# Altium schematic sheet Microcontroller.SchDoc
size A3
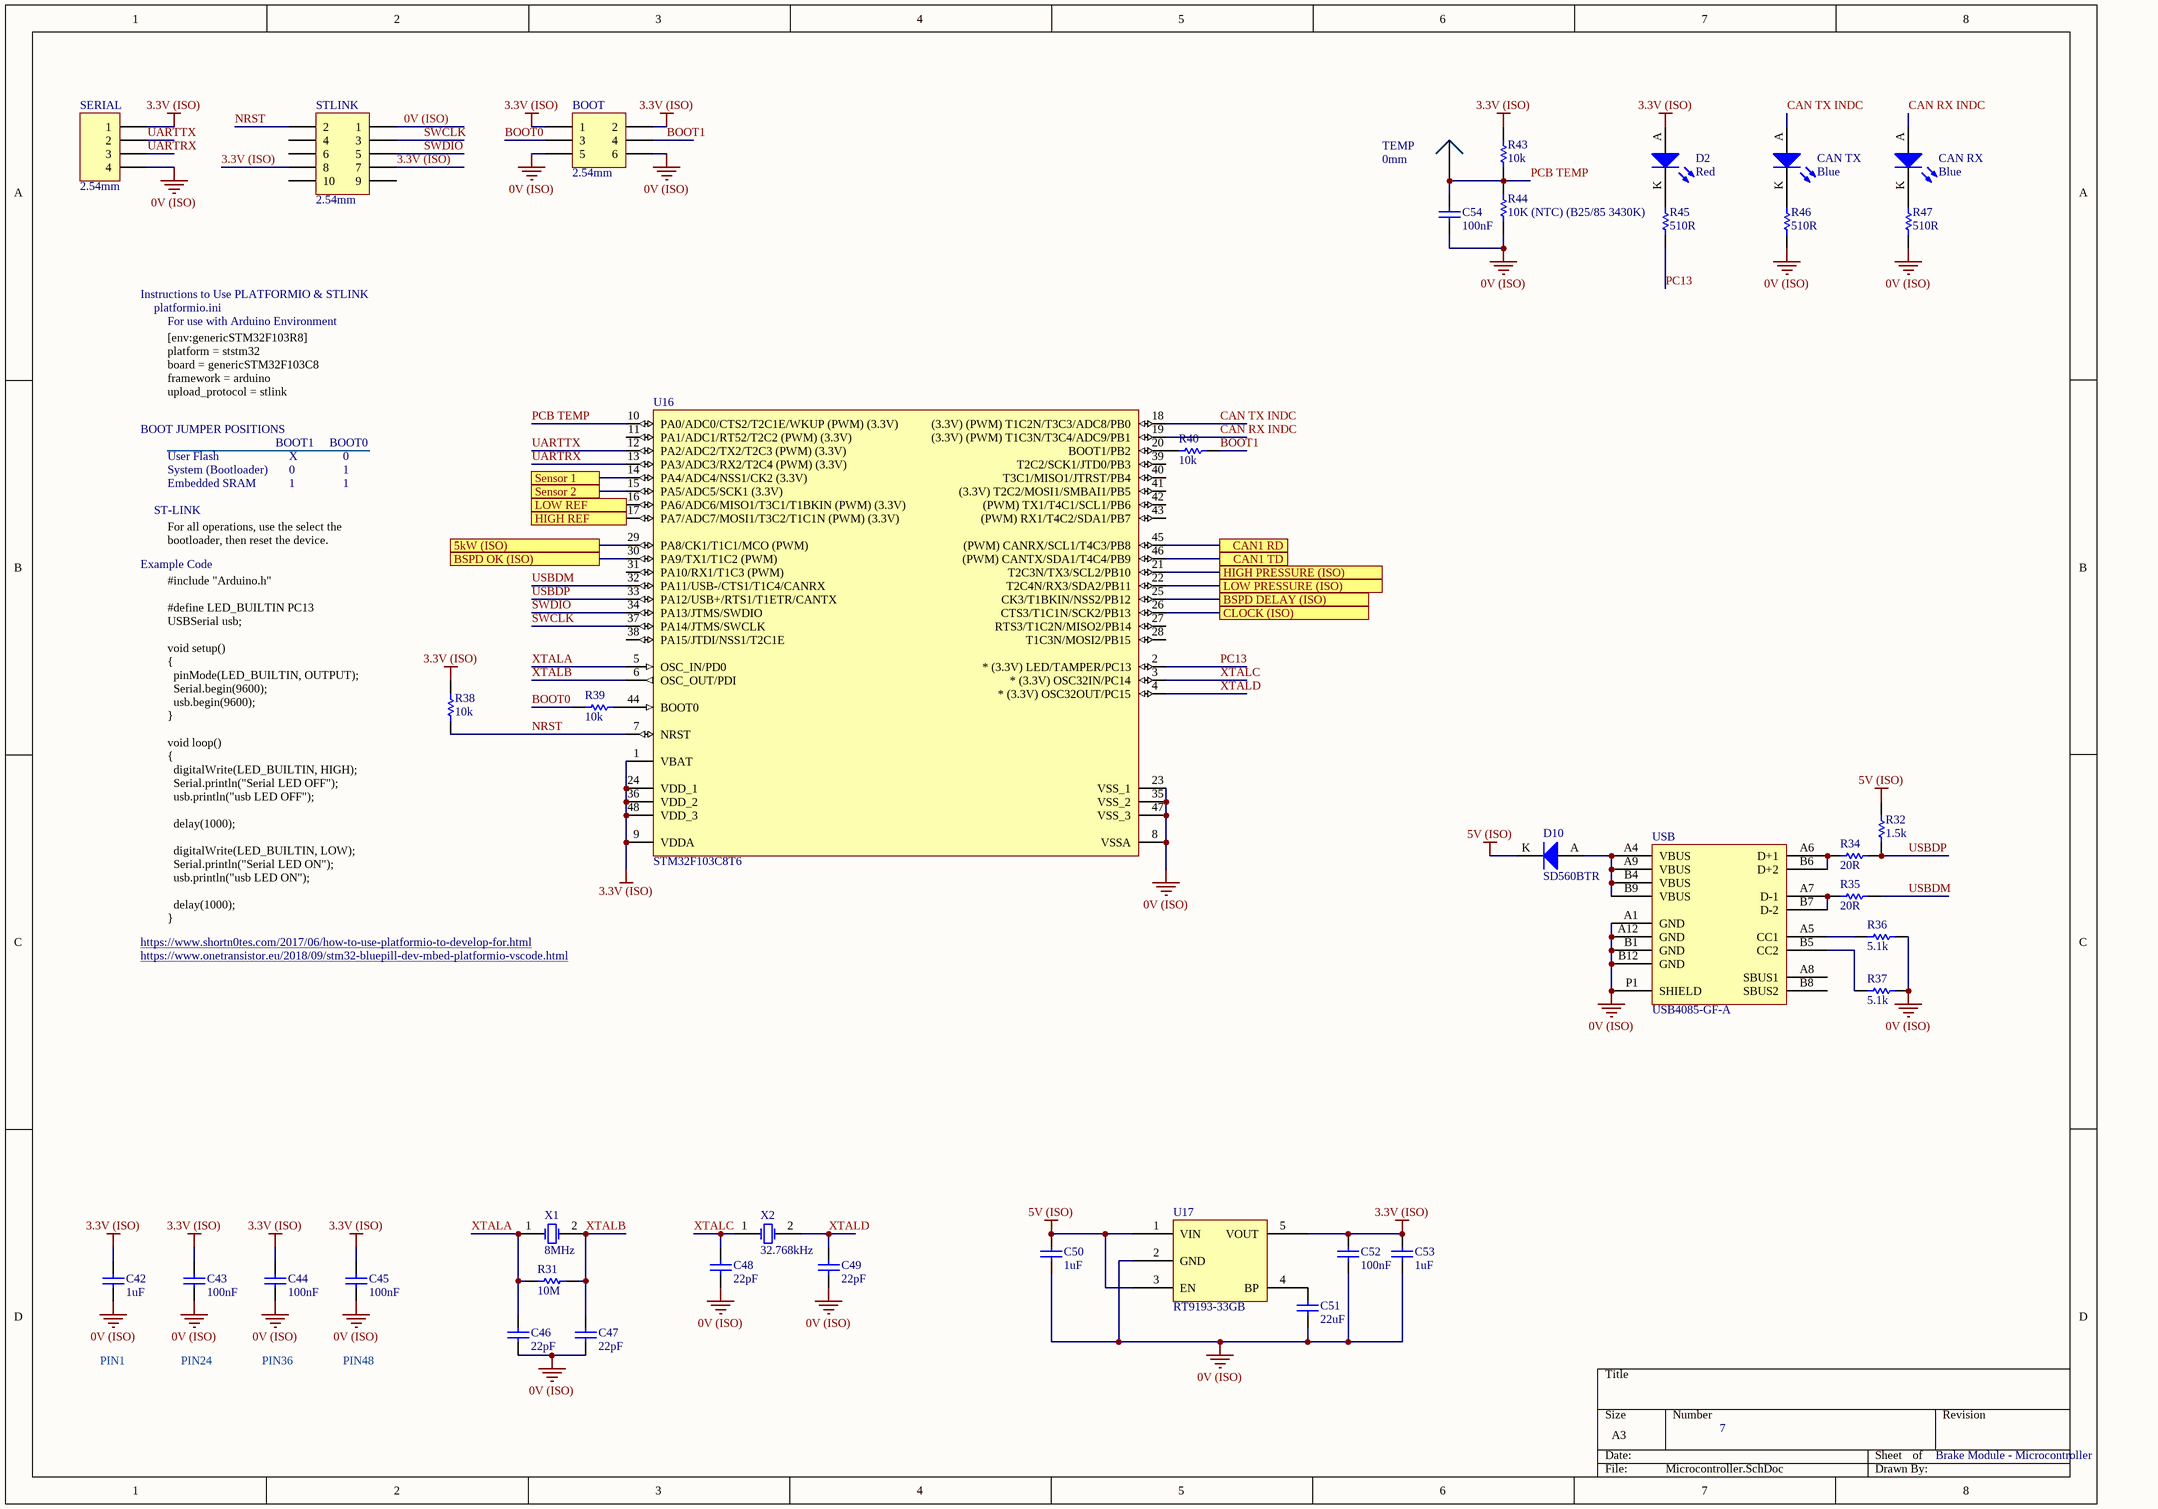
[diagram p0: Microcontroller.SchDoc]

## Parts
BOOT  2.54mm  [TH 2.54mm Header 2x3]
C42  1uF  [0805]
C43  100nF  [0805]
C44  100nF  [0805]
C45  100nF  [0805]
C46  22pF  [0805]
C47  22pF  [0805]
C48  22pF  [0805]
C49  22pF  [0805]
C50  1uF  [0805]
C51  22uF  [1206]
C52  100nF  [0805]
C53  1uF  [0805]
C54  100nF  [0805]
CAN_RX  Blue  [0805 LED]
CAN_TX  Blue  [0805 LED]
D2  Red  [0805 LED]
D10  SD560BTR  [SMB Diode]
R31  10M  [0805]
R32  1.5k  [0805]
R34  20R  [0805]
R35  20R  [0805]
R36  5.1k  [0805]
R37  5.1k  [0805]
R38  10k  [0805]
R39  10k  [0805]
R40  10k  [0805]
R43  10k  [0805]
R44  10K (NTC) (B25/85 3430K)  [0805]
R45  510R  [0805]
R46  510R  [0805]
R47  510R  [0805]
SERIAL  2.54mm  [TH 2.54mm Header 1x4]
STLINK  2.54mm  [TH 2.54mm Header 2x5]
TEMP  0mm  [SMD Test Point]
U16  STM32F103C8T6  [STM 48-LQFP]
U17  RT9193-33GB  [RICHTEK SOT-23-5]
USB  USB4085-GF-A  [USB4085-GF-A]
X1  8MHz  [Abracon HC-49/US]
X2  32.768kHz  [EPSON 2-SMD]

## Ports
5kW (ISO), BSPD DELAY (ISO), BSPD OK (ISO), CAN1 RD, CAN1 TD, CLOCK (ISO), HIGH PRESSURE (ISO), HIGH REF (in), LOW PRESSURE (ISO), LOW REF (in), Sensor 1, Sensor 2

## Nets
0V (ISO): BOOT.5 BOOT.6 C42.1 C43.1 C44.1 C45.1 C46.1 C47.1 C48.1 C49.1 C50.1 C51.1 C52.1 C53.1 C54.1 R36.2 R37.2 R44.1 R46.1 R47.1 SERIAL.4 STLINK.1 U16.8(VSSA) U16.23(VSS_1) U16.35(VSS_2) U16.47(VSS_3) U17.2(GND) USB.A1(GND) USB.A12(GND) USB.B1(GND) USB.B12(GND) USB.P1(SHIELD)
3.3V (ISO): BOOT.1 BOOT.2 C42.2 C43.2 C44.2 C45.2 C52.2 C53.2 D2.A R38.2 R43.2 SERIAL.1 STLINK.7 STLINK.8 U16.1(VBAT) U16.9(VDDA) U16.24(VDD_1) U16.36(VDD_2) U16.48(VDD_3) U17.5(VOUT)
5V (ISO): C50.2 D10.K R32.2 U17.1(VIN) U17.3(EN)
5kW (ISO): U16.29(PA8/CK1/T1C1/MCO_(PWM)) ; port 5kW (ISO)
BOOT0: BOOT.3 R39.1
BOOT1: BOOT.4 R40.2
BSPD DELAY (ISO): U16.25(CK3/T1BKIN/NSS2/PB12) ; port BSPD DELAY (ISO)
BSPD OK (ISO): U16.30(PA9/TX1/T1C2_(PWM)) ; port BSPD OK (ISO)
CAN1 RD: U16.45((PWM)_CANRX/SCL1/T4C3/PB8) ; port CAN1 RD
CAN1 TD: U16.46((PWM)_CANTX/SDA1/T4C4/PB9) ; port CAN1 TD
CAN RX INDC: CAN_RX.A U16.19((3.3V)_(PWM)_T1C3N/T3C4/ADC9/PB1)
CAN TX INDC: CAN_TX.A U16.18((3.3V)_(PWM)_T1C2N/T3C3/ADC8/PB0)
CLOCK (ISO): U16.26(CTS3/T1C1N/SCK2/PB13) ; port CLOCK (ISO)
HIGH PRESSURE (ISO): U16.21(T2C3N/TX3/SCL2/PB10) ; port HIGH PRESSURE (ISO)
HIGH REF: U16.17(PA7/ADC7/MOSI1/T3C2/T1C1N_(PWM)_(3.3V)) ; port HIGH REF
LOW PRESSURE (ISO): U16.22(T2C4N/RX3/SDA2/PB11) ; port LOW PRESSURE (ISO)
LOW REF: U16.16(PA6/ADC6/MISO1/T3C1/T1BKIN_(PWM)_(3.3V)) ; port LOW REF
NRST: R38.1 STLINK.2 U16.7(NRST)
PC13: R45.1 U16.2(*_(3.3V)_LED/TAMPER/PC13)
PCB TEMP: C54.2 R43.1 R44.2 TEMP.1 U16.10(PA0/ADC0/CTS2/T2C1E/WKUP_(PWM)_(3.3V))
Sensor 1: U16.14(PA4/ADC4/NSS1/CK2_(3.3V)) ; port Sensor 1
Sensor 2: U16.15(PA5/ADC5/SCK1_(3.3V)) ; port Sensor 2
SWCLK: STLINK.3 U16.37(PA14/JTMS/SWCLK)
SWDIO: STLINK.5 U16.34(PA13/JTMS/SWDIO)
UARTRX: SERIAL.3 U16.13(PA3/ADC3/RX2/T2C4_(PWM)_(3.3V))
UARTTX: SERIAL.2 U16.12(PA2/ADC2/TX2/T2C3_(PWM)_(3.3V))
USBDM: R35.2 U16.32(PA11/USB-/CTS1/T1C4/CANRX)
USBDP: R32.1 R34.2 U16.33(PA12/USB+/RTS1/T1ETR/CANTX)
XTALA: C46.2 R31.1 U16.5(OSC_IN/PD0) X1.1(OSC1)
XTALB: C47.2 R31.2 U16.6(OSC_OUT/PDI) X1.2(OSC2)
XTALC: C48.2 U16.3(*_(3.3V)_OSC32IN/PC14) X2.1(OSC1)
XTALD: C49.2 U16.4(*_(3.3V)_OSC32OUT/PC15) X2.2(OSC2)
NetC51_2: C51.2 U17.4(BP)
NetCAN_RX_K: CAN_RX.K R47.2
NetCAN_TX_K: CAN_TX.K R46.2
NetD2_K: D2.K R45.2
NetD10_A: D10.A USB.A4(VBUS) USB.A9(VBUS) USB.B4(VBUS) USB.B9(VBUS)
NetR34_1: R34.1 USB.A6(D+1) USB.B6(D+2)
NetR35_1: R35.1 USB.A7(D-1) USB.B7(D-2)
NetR36_1: R36.1 USB.A5(CC1)
NetR37_1: R37.1 USB.B5(CC2)
NetR39_2: R39.2 U16.44(BOOT0)
NetR40_1: R40.1 U16.20(BOOT1/PB2)

Not connected (* = marked no-connect by the designer): STLINK 4 6 9 10; U16 11(PA1/ADC1/RT52/T2C2_(PWM)_(3.3V)) 27(RTS3/T1C2N/MISO2/PB14) 28(T1C3N/MOSI2/PB15) 31(PA10/RX1/T1C3_(PWM)) 38(PA15/JTDI/NSS1/T2C1E) 39(T2C2/SCK1/JTD0/PB3) 40(T3C1/MISO1/JTRST/PB4) 41((3.3V)_T2C2/MOSI1/SMBAI1/PB5) 42((PWM)_TX1/T4C1/SCL1/PB6) 43((PWM)_RX1/T4C2/SDA1/PB7); USB A8(SBUS1) B8(SBUS2)

## Notes on the sheet
- Instructions to Use PLATFORMIO & STLINK
- platformio.ini
- For use with Arduino Environment
- BOOT JUMPER POSITIONS
- [env:genericSTM32F103R8]
  platform = ststm32
  board = genericSTM32F103C8
  framework = arduino
  upload_protocol = stlink
- BOOT1
- BOOT0
- ST-LINK
- User Flash
- System (Bootloader)
- Embedded SRAM
- X
- 1
- 0
- Example Code
- For all operations, use the select the bootloader, then reset the device.
- #include "Arduino.h"
  #define LED_BUILTIN PC13
  USBSerial usb;
  void setup()
  {
  pinMode(LED_BUILTIN, OUTPUT);
  Serial.begin(9600);
  usb.begin(9600);
  }
  void loop()
  {
  digitalWrite(LED_BUILTIN, HIGH);
  Serial.println("Serial LED OFF");
  usb.println("usb LED OFF");
  delay(1000);
  digitalWrite(LED_BUILTIN, LOW);
  Serial.println("Serial LED ON");
  usb.println("usb LED ON");
  delay(1000);
  }
- https://www.shortn0tes.com/2017/06/how-to-use-platformio-to-develop-for.html
- https://www.onetransistor.eu/2018/09/stm32-bluepill-dev-mbed-platformio-vscode.html
- PIN1
- PIN24
- PIN36
- PIN48
- 7
- Brake Module - Microcontroller
- Title
- Size:
- Date:
- A3
- Number:
- Time:
- Revision:
- Sheet
- of
- File:

## Library data of the parts
BOOT = TH 2.54mm Header 2x3: Positions: 6; Angle: 0; Flange: No; Contact: NA; Part Number: TH 2.54mm Header 2x3; Pitch: 2.54mm; Row Spacing: 2.54mm
C42 C50 C53 = AC0805KKX7R8BB105: Manufacturer: YAGEO; Tolerance: 10%; Material: X7R; Rated Voltage: 25V; Part Number: AC0805KKX7R8BB105; Value: 1uF; Digikey Part Number: DO NOT USE FOR NEW DESIGNS
C43-C45 C52 C54 = GCM21BR71H104KA37L: Manufacturer: muRata; Tolerance: ±10%; Material: X7R; Rated Voltage: 50V; Part Number: GCM21BR71H104KA37L; Value: 100nF; Digikey Part Number: 490-6064-1-ND
C46-C49 = GRM21A5C2E220JW01D: Manufacturer: muRata; Tolerance: ±5%; Material: C0G, NP0; Rated Voltage: 250V; Part Number: GRM21A5C2E220JW01D; Value: 22pF; Digikey Part Number: 490-5534-1-ND
C51 = CC1206MKX5R7BB226: Manufacturer: YAGEO; Tolerance: 20%; Material: Ceramic; Rated Voltage: 16V; Part Number: CC1206MKX5R7BB226; Value: 22uF; Digikey Part Number: 311-1997-2-ND
CAN_RX CAN_TX = SML-MN2BCTT86C: LED BLUE CLEAR 2012 SMD; Manufacturer: ROHM Semiconductor; Part Number: SML-MN2BCTT86C; Colour: Blue; Digikey Part Number: 846-1207-1-ND; Digikey Link: https://www.digikey.com/product-detail/en/rohm-semiconductor/SMLMN2BCTT86C/846-1207-1-ND/6057239
D2 = SML-210LTT86: Red LED Indication - Discrete 1.75V 0805 (2012 Metric); Manufacturer: ROHM Semiconductor; Part Number: SML-210LTT86; Colour: Red; Digikey Part Number: 511-1286-1-ND; Digikey Link: https://www.digikey.com/product-detail/en/rohm-semiconductor/SML-210LTT86/511-1286-1-ND/637099
D10 = SD560BTR: 1.2V_F 600V 5A SMB; Manufacturer: SMC Diode Solutions; Part Number: SD560BTR; Digikey Part Number: 1655-1530-2-ND; Digikey Link: https://www.digikey.com/product-detail/en/smc-diode-solutions/SD560BTR/1655-1530-2-ND/6022620
R31 = RC0805FR0710ML: Manufacturer: YAGEO; Tolerance: 0.01; Rated Voltage: 0.125W; Part Number: RC0805FR0710ML; Value: 10M; Material: FR-07; Digikey Part Number: 311-10.0MCRCT-ND
R32 = RC0805FR071K5L: Manufacturer: YAGEO; Tolerance: 0.01; Rated Voltage: 0.125W; Part Number: RC0805FR071K5L; Value: 1.5k; Material: FR-07; Digikey Part Number: 311-1.50KCRCT-ND
R34 R35 = RC0805FR0720RL: Manufacturer: YAGEO; Tolerance: 0.01; Rated Voltage: 0.125W; Part Number: RC0805FR0720RL; Value: 20R; Material: FR-07; Digikey Part Number: 311-20.0CRCT-ND
R36 R37 = RC0805FR075K1L: Manufacturer: YAGEO; Tolerance: 0.01; Rated Voltage: 0.125W; Part Number: RC0805FR075K1L; Value: 5.1k; Material: FR-07; Digikey Part Number: 311-5.10KCRCT-ND
R38-R40 R43 = RC0805FR0710KL: Manufacturer: YAGEO; Tolerance: 0.01; Rated Voltage: 0.125W; Part Number: RC0805FR0710KL; Value: 10k; Material: FR-07; Digikey Part Number: 311-10.0KCRCT-ND
R44 = NTCS0805E3103FLT: Manufacturer: Vishay Beyschlag; Tolerance: 0.01; Rated Voltage: 210mW; Part Number: NTCS0805E3103FLT; Value: 10K (NTC) (B25/85 3430K); Digikey Part Number: BC2733CT-ND
R45-R47 = RC0805FR07510RL: Manufacturer: YAGEO; Tolerance: 0.01; Rated Voltage: 0.125W; Part Number: RC0805FR07510RL; Value: 510R; Material: FR-07; Digikey Part Number: 311-510CRCT-ND
SERIAL = TH 2.54mm Header 1x4: Positions: 4; Angle: 0; Flange: No; Contact: NA; Part Number: TH 2.54mm Header 1x4; Pitch: 2.54mm; Row Spacing: 2.54mm
STLINK = TH 2.54mm Header 2x5: Positions: 10; Angle: 0; Flange: No; Contact: NA; Part Number: TH 2.54mm Header 2x5; Pitch: 2.54mm; Row Spacing: 2.54mm
TEMP = SMD Test Point: Positions: 1; Row Spacing: 0; Flange: No; Contact: NA; Part Number: SMD Test Point; Pitch: 0mm; Angle: 0
U16 = STM32F103C8T6: ARM® Cortex®-M3 STM32F1 Microcontroller IC 32-Bit 72MHz 64KB (64K x 8) FLASH; Manufacturer: STMicroelectronics; Part Number: STM32F103C8T6; Digikey Part Number: 497-6063-ND; Digikey Link: https://www.digikey.com/product-detail/en/stmicroelectronics/STM32F103C8T6/497-6063-ND/1646338
U17 = RT9193-33GB: IC REG LINEAR 3.3V 300MA SOT23-5; Manufacturer: Richtek; Part Number: RT9193-33GB; Digikey Part Number: 1028-1014-1-ND; Digikey Link: https://www.digikey.com/products/en?keywords=1028-1014-1-ND
USB = USB4085-GF-A: USB - C (Type - C) USB 2.0 Receptacle Connector 16 Position Through Hole, Right Angle; Angle: 90; Part Number: USB4085-GF-A; Digikey Part Number: 2073-USB4085-GF-ACT-ND; Digikey Link: https://www.digikey.ee/product-detail/en/gct/USB4085-GF-A/2073-USB4085-GF-ACT-ND/9859733
X1 = ABLS-8.000MHZ-B4-T: Manufacturer: Abracon LLC; Load Capacitance: 18pF; ESR: 80R; Part Number: ABLS-8.000MHZ-B4-T; Value: 8MHz; Digikey Part Number: 535-10212-2-ND; Digikey Link: https://www.digikey.com/product-detail/en/abracon-llc/ABLS-8.000MHZ-B4-T/535-10212-2-ND/2184155
X2 = FC-135 32.7680KA-A5: Manufacturer: EPSON; Load Capacitance: 12.5pF; ESR: 70k; Part Number: FC-135 32.7680KA-A5; Value: 32.768kHz; Digikey Part Number: SER4103TR-ND; Digikey Link: https://www.digikey.com/product-detail/en/epson/FC-135-32.7680KA-A5/SER4103TR-ND/5259895